# Altium project Charger Board.PrjPcb (part 3 of 3)

## Sheet Interlock.SchDoc
size A3
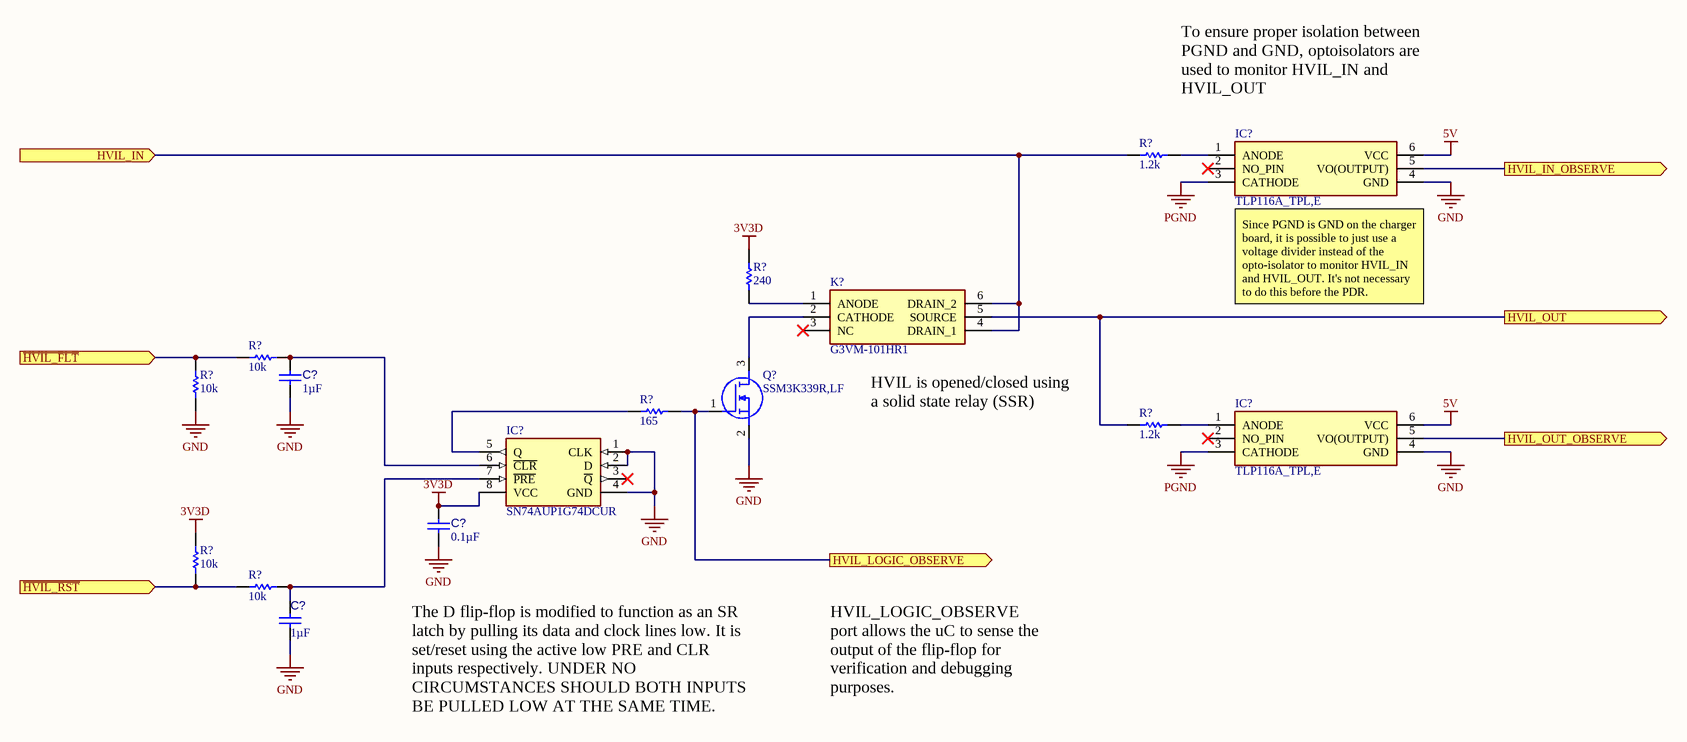
[diagram p4: Interlock.SchDoc]

### Parts
(Parts that share a designator on the sheet are numbered #1, #2 ... from top to bottom, then left to right.)
C?#25  1µF  [CAPC2013X145X50ML20T25]
C?#26  0.1µF  [CAPC2013X145X50ML20T25]
C?#27  1µF  [CAPC2013X145X50ML20T25]
IC?#3  TLP116A_TPL,E  [SOT127P700X230-6N]
IC?#4  TLP116A_TPL,E  [SOT127P700X230-6N]
IC?#5  SN74AUP1G74DCUR  [SOT50P310X90-8N]
K?  G3VM-101HR1  [G3VM101HR1]
Q?#4  SSM3K339R,LF  [SOTFL95P240X88-3N]
R?#30  1.2k  [RESC2013X50X35ML15T15]
R?#31  240  [RESC2013X50X35ML15T15]
R?#32  10k  [RESC2013X50X35ML15T15]
R?#33  10k  [RESC2013X50X35ML15T15]
R?#34  165  [RESC2013X50X35ML15T15]
R?#35  1.2k  [RESC2013X50X35ML15T15]
R?#36  10k  [RESC2013X50X35ML15T15]
R?#37  10k  [RESC2013X50X35ML15T15]

### Ports
HVIL_IN (in), HVIL_IN_OBSERVE (out), HVIL_LOGIC_OBSERVE (out), HVIL_OUT (out), HVIL_OUT_OBSERVE (out), ~{HVIL_FLT} (in), ~{HVIL_RST} (in)

### Nets
3V3D: C?#26.2 IC?#5.8(VCC) R?#31.1 R?#36.2
5V: IC?#3.6(VCC) IC?#4.6(VCC)
GND: C?#25.2 C?#26.1 C?#27.1 IC?#3.4(GND) IC?#4.4(GND) IC?#5.1(CLK) IC?#5.2(D) IC?#5.4(GND) Q?#4.2(S) R?#33.1
PGND: IC?#3.3(CATHODE) IC?#4.3(CATHODE)
NetC?#25_1: C?#25.1 IC?#5.6(~{CLR}) R?#32.1
NetC?#27_2: C?#27.2 IC?#5.7(~{PRE}) R?#37.1
NetIC?#2_92: Q?#4.1(G) R?#34.2 ; port HVIL_LOGIC_OBSERVE
NetIC?#2_93: IC?#3.5(VO(OUTPUT)) ; port HVIL_IN_OBSERVE
NetIC?#2_94: IC?#4.5(VO(OUTPUT)) ; port HVIL_OUT_OBSERVE
NetIC?#2_95: R?#32.2 R?#33.2 ; port ~{HVIL_FLT}
NetIC?#2_96: R?#36.1 R?#37.2 ; port ~{HVIL_RST}
NetIC?#3_1: IC?#3.1(ANODE) R?#30.2
NetIC?#4_1: IC?#4.1(ANODE) R?#35.2
NetIC?#5_5: IC?#5.5(Q) R?#34.1
NetJ?#8_1: K?.5(SOURCE) R?#35.1 ; port HVIL_OUT
NetJ?#8_2: K?.4(DRAIN_1) K?.6(DRAIN_2) R?#30.1 ; port HVIL_IN
NetK?_1: K?.1(ANODE) R?#31.2
NetK?_2: K?.2(CATHODE) Q?#4.3(D)

Not connected (* = marked no-connect by the designer): IC?#3 2(NO_PIN)*; IC?#4 2(NO_PIN)*; IC?#5 3(~{Q})*; K? 3(NC)*

### Notes on the sheet
- To ensure proper isolation between PGND and GND, optoisolators are used to monitor HVIL_IN and HVIL_OUT
- (near IC?#3) Since PGND is GND on the charger board, it is possible to just use a voltage divider instead of the opto-isolator to monitor HVIL_IN and HVIL_OUT. It's not necessary to do this before the PDR.
- (near K?) HVIL is opened/closed using a solid state relay (SSR)
- The D flip-flop is modified to function as an SR latch by pulling its data and clock lines low. It is set/reset using the active low PRE and CLR inputs respectively. UNDER NO CIRCUMSTANCES SHOULD BOTH INPUTS BE PULLED LOW AT THE SAME TIME.
- HVIL_LOGIC_OBSERVE port allows the uC to sense the output of the flip-flop for verification and debugging purposes.

### Library data of the parts
C?#25 C?#27 = CMP-001-00010-4: Chip Capacitor, 1 uF, +/-10%, 25 V, 0805 (2012 Metric); Manufacturer: KEMET; Manufacturer Part Number: C0805C105K3RACTU; Dielectric Material: Ceramic; Capacitance: 1uF; Tolerance: 10%; Dielectric: X7R; Voltage: 25V; Value: 1µF; Supplier 1: Digi-Key; Supplier Part Number 1: 399-8004-1-ND; RoHS: Yes; Category: Ceramic Capacitors; Stock 1: 360844; Pricing 1: 1=0.14000, 10=0.10100, 50=0.05720, 100=0.04740, 500=0.03322, 1000=0.02750 (USD); Mount: Surface Mount; Case/Package: 0805; Number of Pins: 2; Contact Plating: Tin,Matte; Case Code (Imperial): 0805; Case Code (Metric): 2012; Min Operating Temperature: -55°C; Max Operating Temperature: 125°C; Packaging: Tape and Reel; Termination: SMD/SMT; Package Quantity: 1; Voltage Rating: 25V; Voltage Rating (DC): 25V; Length: 2mm; Height: 1.25mm; Depth: 1.25mm; Width: 0.049inch; Thickness: 0.055inch; Radiation Hardening: No; REACH SVHC: No SVHC; ComponentLink1URL: https://datasheet.ciiva.com/6074/kem-c1002-x7r-smd-6074661.pdf?src-supplier=Farnell; ComponentLink1Description: https://datasheet.ciiva.com/6074/kem-c1002-x7r-smd-6074661.pdf?src-supplier=Farnell; ComponentLink2URL: https://datasheet.ciiva.com/28610/1918693-28610874.pdf?src-supplier=Element14; ComponentLink2Description: https://datasheet.ciiva.com/28610/1918693-28610874.pdf?src-supplier=Element14; ComponentLink3URL: https://datasheet.ciiva.com/46443/1851736-46443533.pdf?src-supplier=Element14; ComponentLink3Description: https://datasheet.ciiva.com/46443/1851736-46443533.pdf?src-supplier=Element14
C?#26 = CMP-001-00010-4: Chip Capacitor, 0.1 uF, +/-10%, 25 V, 0805 (2012 Metric); Manufacturer: KEMET; Manufacturer Part Number: C0805C104K3RACTU; Dielectric Material: Ceramic; Tolerance: 10%; Capacitance: 100nF; Dielectric: X7R; Voltage: 25V; Value: 0.1µF; Supplier 1: Digi-Key; Supplier Part Number 1: 399-1168-1-ND; RoHS: Yes; Category: Ceramic Capacitors; Stock 1: 417116; Pricing 1: 1=0.14000, 10=0.10000, 50=0.05660, 100=0.04680, 500=0.03284, 1000=0.02719 (USD); Mount: Surface Mount; Case/Package: 0805; Min Operating Temperature: -55°C; Max Operating Temperature: 125°C; Packaging: Tape and Reel; Termination: SMD/SMT; Length: 2mm; Height: 0.9mm; Depth: 1.25mm; Radiation Hardening: No; ComponentLink1URL: https://datasheet.ciiva.com/18193/getdatasheetpartid-385649-18193413.pdf?src-supplier=Verical; ComponentLink1Description: https://datasheet.ciiva.com/18193/getdatasheetpartid-385649-18193413.pdf?src-supplier=Verical; ComponentLink2URL: https://datasheet.ciiva.com/7842/kem-c1002-x7r-smd-7842536.pdf?src-supplier=Element14; ComponentLink2Description: https://datasheet.ciiva.com/7842/kem-c1002-x7r-smd-7842536.pdf?src-supplier=Element14; ComponentLink3URL: https://datasheet.ciiva.com/7842/kem-c1002-x7r-smd-7842538.pdf?src-supplier=Element14; ComponentLink3Description: https://datasheet.ciiva.com/7842/kem-c1002-x7r-smd-7842538.pdf?src-supplier=Element14
IC?#3 IC?#4 = TLP116A_TPL,E: Integrated Circuit; Manufacturer_Name: Toshiba; Manufacturer_Part_Number: TLP116A(TPL,E; Datasheet Link: https://media.digikey.com/pdf/Data%20Sheets/Toshiba%20PDFs/TLP116A.pdf; Height: 2.3mm; Arrow Part Number: TLP116A(TPL,E; Arrow Price/Stock: https://www.arrow.com/en/products/tlp116a-tple/toshiba; Mouser Part Number: 757-TLP116A(TPLE; Mouser Price/Stock: https://www.mouser.co.uk/ProductDetail/Toshiba/TLP116ATPLE?qs=HVbQlW5zcXWPuFTVF%252BZ0qw%3D%3D
IC?#5 = SN74AUP1G74DCUR: Integrated Circuit; Manufacturer_Name: Texas Instruments; Datasheet Link: http://www.ti.com/lit/gpn/sn74aup1g74; Height: 0.9mm; Manufacturer_Part_Number: SN74AUP1G74DCUR; Arrow Part Number: SN74AUP1G74DCUR; Arrow Price/Stock: https://www.arrow.com/en/products/sn74aup1g74dcur/texas-instruments; Mouser Part Number: 595-SN74AUP1G74DCUR; Mouser Price/Stock: https://www.mouser.co.uk/ProductDetail/Texas-Instruments/SN74AUP1G74DCUR?qs=7kv20MEVUlht0wF4P3v%252Bhg%3D%3D
K? = G3VM-101HR1: Relay or Contactor; Manufacturer_Name: Omron Electronics; Datasheet Link: https://componentsearchengine.com/Datasheets/1/G3VM-101HR1.pdf; Height: 2.1mm; Manufacturer_Part_Number: G3VM-101HR1; Arrow Part Number: G3VM-101HR1; Arrow Price/Stock: https://www.arrow.com/en/products/g3vm-101hr1/omron; Mouser Part Number: 653-G3VM-101HR1; Mouser Price/Stock: https://www.mouser.com/Search/Refine.aspx?Keyword=653-G3VM-101HR1
Q?#4 = SSM3K339R,LF: MOSFET (N-Channel); Manufacturer_Name: Toshiba; Datasheet Link: https://www.arrow.com/en/products/ssm3k339rlf/toshiba; Height: 0.88mm; Manufacturer_Part_Number: SSM3K339R,LF; Arrow Part Number: SSM3K339R,LF; Arrow Price/Stock: https://www.arrow.com/en/products/ssm3k339rlf/toshiba; Mouser Part Number: 757-SSM3K339RLF; Mouser Price/Stock: https://www.mouser.co.uk/ProductDetail/Toshiba/SSM3K339RLF?qs=vPP9GyyTAo2h4IM%252B%252BLvR%252BA%3D%3D
R?#30 R?#35 = CMP-009-00001-4: Chip Resistor, 1.2k Ohm, +/- 1%, 125 mW, -55 to 155 degC, 0805 (2012 Metric); Manufacturer: TE Connectivity; Manufacturer Part Number: CRGCQ0805F1K2; Resistance: 1.2kR; Max Power Dissipation: 125mW; Temperature Coefficient: 100ppm/°C; Value: 1.2k; Supplier 1: Digi-Key; Supplier Part Number 1: A129750CT-ND; RoHS: No; Category: Chip SMD Resistors; Stock 1: 34317; Pricing 1: 1=0.10000, 10=0.04700, 100=0.01890, 1000=0.00851, 2500=0.00738 (USD); Case/Package: 0805; Min Operating Temperature: -55°C; Max Operating Temperature: 155°C; Composition: Thick Film; Features: Moisture Resistant,Automotive AEC-Q200; Packaging: Cut Tape; Tolerance: 1%; Number of Terminations: 2; ComponentLink1URL: https://4donline.ihs.com/images/VipMasterIC/IC/TYEL/TYEL-S-A0004929575/TYEL-S-A0004929575-1.pdf?hkey=52A5661711E402568146F3353EA87419&src-supplier=Newark; ComponentLink1Description: https://4donline.ihs.com/images/VipMasterIC/IC/TYEL/TYEL-S-A0004929575/TYEL-S-A0004929575-1.pdf?hkey=52A5661711E402568146F3353EA87419&src-supplier=Newark; ComponentLink2URL: https://4donline.ihs.com/images/VipMasterIC/IC/TYEL/TYEL-S-A0004929575/TYEL-S-A0004929575-1.pdf?hkey=52A5661711E402568146F3353EA87419&src-supplier=Farnell; ComponentLink2Description: https://4donline.ihs.com/images/VipMasterIC/IC/TYEL/TYEL-S-A0004929575/TYEL-S-A0004929575-1.pdf?hkey=52A5661711E402568146F3353EA87419&src-supplier=Farnell; ComponentLink3URL: https://www.te.com/commerce/DocumentDelivery/DDEController?Action=srchrtrv&DocNm=1773204-3&DocType=DS&DocLang=English&src-supplier=Digi-Key; ComponentLink3Description: https://www.te.com/commerce/DocumentDelivery/DDEController?Action=srchrtrv&DocNm=1773204-3&DocType=DS&DocLang=English&src-supplier=Digi-Key
R?#31 = CMP-009-00001-4: Chip Resistor, 240 Ohm, +/- 1%, 125 mW, -55 to 155 degC, 0805 (2012 Metric); Manufacturer: Panasonic; Manufacturer Part Number: ERA-6AEB241V; Resistance: 240R; Power Rating: 125mW; Tolerance: 0.1%; Voltage Rating: 100V; Temperature Coefficient: 25ppm/°C; Value: 240; Supplier 1: Digi-Key; Supplier Part Number 1: P240DACT-ND; RoHS: Yes; Category: Chip SMD Resistors; Stock 1: 12724; Pricing 1: 1=0.33000, 10=0.27800, 100=0.10850, 1000=0.04541, 2500=0.04163 (USD); Mount: Surface Mount; Case/Package: 0805; Number of Pins: 2; Case Code (Metric): 2012; Case Code (Imperial): 0805; Contact Plating: Tin; Min Operating Temperature: -55°C; Max Operating Temperature: 155°C; Packaging: Tape and Reel; Package Quantity: 1; Composition: Thin Film; Number of Terminations: 2; Military Standard: Not; Termination: Solder; Max Power Dissipation: 125mW; Voltage Rating (DC): 100V; Features: Automotive AEC-Q200; Length: 2mm; Height: 0.5mm; Width: 1.25mm; Depth: 1.25mm; Radiation Hardening: No; REACH SVHC: No SVHC; Lead Free: Lead Free; ComponentLink1URL: https://datasheet.ciiva.com/29184/452815-da-01-en-widerstand-0805-era-29184072.pdf?src-supplier=Conrad; ComponentLink1Description: https://datasheet.ciiva.com/29184/452815-da-01-en-widerstand-0805-era-29184072.pdf?src-supplier=Conrad; ComponentLink2URL: https://datasheet.ciiva.com/5915/485442-5915205.pdf?src-supplier=Farnell; ComponentLink2Description: https://datasheet.ciiva.com/5915/485442-5915205.pdf?src-supplier=Farnell; ComponentLink3URL: https://datasheet.ciiva.com/43455/485442-43455397.pdf?src-supplier=Farnell; ComponentLink3Description: https://datasheet.ciiva.com/43455/485442-43455397.pdf?src-supplier=Farnell; ComponentLink4URL: https://datasheet.ciiva.com/30154/54aoa0000ce26-30154486.pdf?src-supplier=Onlinecomponents.com; ComponentLink4Description: https://datasheet.ciiva.com/30154/54aoa0000ce26-30154486.pdf?src-supplier=Onlinecomponents.com; ComponentLink5URL: https://datasheet.ciiva.com/48425/era-eng-tds-48425782.pdf?src-supplier=Distrelec; ComponentLink5Description: https://datasheet.ciiva.com/48425/era-eng-tds-48425782.pdf?src-supplier=Distrelec; ComponentLink6URL: https://datasheet.ciiva.com/5915/485442-5915208.pdf?src-supplier=Farnell; ComponentLink6Description: https://datasheet.ciiva.com/5915/485442-5915208.pdf?src-supplier=Farnell; ComponentLink7URL: https://datasheet.ciiva.com/46389/485442-46389960.pdf?src-supplier=Element14; ComponentLink7Description: https://datasheet.ciiva.com/46389/485442-46389960.pdf?src-supplier=Element14; ComponentLink8URL: https://datasheet.ciiva.com/46389/485442-46389961.pdf?src-supplier=Element14; ComponentLink8Description: https://datasheet.ciiva.com/46389/485442-46389961.pdf?src-supplier=Element14; ComponentLink9URL: https://datasheet.ciiva.com/48536/era-eng-tds-48536634.pdf?src-supplier=Distrelec; ComponentLink9Description: https://datasheet.ciiva.com/48536/era-eng-tds-48536634.pdf?src-supplier=Distrelec; ComponentLink10URL: https://datasheet.ciiva.com/22739/485442-22739483.pdf?src-supplier=Element14; ComponentLink10Description: https://datasheet.ciiva.com/22739/485442-22739483.pdf?src-supplier=Element14; ComponentLink11URL: https://datasheet.ciiva.com/17206/aoa0000ce26-17206700.pdf?src-supplier=Avnet+Europe; ComponentLink11Description: https://datasheet.ciiva.com/17206/aoa0000ce26-17206700.pdf?src-supplier=Avnet+Europe; ComponentLink12URL: https://datasheet.ciiva.com/43457/485442-43457869.pdf?src-supplier=Farnell; ComponentLink12Description: https://datasheet.ciiva.com/43457/485442-43457869.pdf?src-supplier=Farnell
R?#32 R?#36 R?#37 = CMP-009-00001-4: Chip Resistor, 10k Ohm, +/- 1%, 125 mW, -55 to 155 degC, 0805 (2012 Metric); Manufacturer: Yageo; Manufacturer Part Number: RC0805FR-0710KL; Resistance: 10kR; Temperature Coefficient: 100ppm/°C; Power Rating: 125mW; Voltage Rating: 150V; Value: 10k; Supplier 1: Digi-Key; Supplier Part Number 1: 311-10.0KCRCT-ND; RoHS: Yes; Category: Chip SMD Resistors; Stock 1: 19063106; Pricing 1: 1=0.10000, 10=0.03900, 100=0.01570, 1000=0.00705, 2500=0.00612 (USD); Case/Package: 0805; Case Code (Imperial): 0805; Case Code (Metric): 2012; Min Operating Temperature: -55°C; Max Operating Temperature: 155°C; Packaging: Tape and Reel; Tolerance: 1%; Composition: Thick Film; Package Quantity: 1; Termination: SMD/SMT; Number of Terminations: 2; Military Standard: Not; Max Power Dissipation: 125mW; Features: Moisture Resistant; Length: 2mm; Height: 0.024inch; Width: 0.049inch; Depth: 1.25mm; REACH SVHC: Unknown; Lead Free: Lead Free; ComponentLink1URL: https://datasheet.ciiva.com/11808/0900766b8106beab-11808151.pdf?src-supplier=RSComponents; ComponentLink1Description: https://datasheet.ciiva.com/11808/0900766b8106beab-11808151.pdf?src-supplier=RSComponents; ComponentLink2URL: https://datasheet.ciiva.com/12669/rc0805-12669688.pdf?src-supplier=Mouser; ComponentLink2Description: https://datasheet.ciiva.com/12669/rc0805-12669688.pdf?src-supplier=Mouser; ComponentLink3URL: https://datasheet.ciiva.com/46447/444164-46447563.pdf?src-supplier=Element14; ComponentLink3Description: https://datasheet.ciiva.com/46447/444164-46447563.pdf?src-supplier=Element14; ComponentLink4URL: https://datasheet.ciiva.com/2456/pyu-r-int-thick-7-2456972.pdf?src-supplier=Digi-Key; ComponentLink4Description: https://datasheet.ciiva.com/2456/pyu-r-int-thick-7-2456972.pdf?src-supplier=Digi-Key; ComponentLink5URL: https://datasheet.ciiva.com/2456/pyu-r-int-thick-7-2456973.pdf?src-supplier=Digi-Key; ComponentLink5Description: https://datasheet.ciiva.com/2456/pyu-r-int-thick-7-2456973.pdf?src-supplier=Digi-Key; ComponentLink6URL: https://datasheet.ciiva.com/2456/pyu-r-int-thick-7-2456974.pdf?src-supplier=Digi-Key; ComponentLink6Description: https://datasheet.ciiva.com/2456/pyu-r-int-thick-7-2456974.pdf?src-supplier=Digi-Key; ComponentLink7URL: https://datasheet.ciiva.com/16747/rc0805-16747087.pdf?src-supplier=Future+Electronics; ComponentLink7Description: https://datasheet.ciiva.com/16747/rc0805-16747087.pdf?src-supplier=Future+Electronics
R?#33 = CMP-009-00001-4: Chip Resistor, 1.2k Ohm, +/- 1%, 125 mW, -55 to 155 degC, 0805 (2012 Metric); Manufacturer: Yageo; Manufacturer Part Number: RC0805FR-0710KL; Resistance: 10kR; Temperature Coefficient: 100ppm/°C; Power Rating: 125mW; Voltage Rating: 150V; Value: 10k; Supplier 1: Digi-Key; Supplier Part Number 1: 311-10.0KCRCT-ND; RoHS: Yes; Category: Chip SMD Resistors; Stock 1: 19063106; Pricing 1: 1=0.10000, 10=0.03900, 100=0.01570, 1000=0.00705, 2500=0.00612 (USD); Case/Package: 0805; Case Code (Imperial): 0805; Case Code (Metric): 2012; Min Operating Temperature: -55°C; Max Operating Temperature: 155°C; Packaging: Tape and Reel; Tolerance: 1%; Composition: Thick Film; Package Quantity: 1; Termination: SMD/SMT; Number of Terminations: 2; Military Standard: Not; Max Power Dissipation: 125mW; Features: Moisture Resistant; Length: 2mm; Height: 0.024inch; Width: 0.049inch; Depth: 1.25mm; REACH SVHC: Unknown; Lead Free: Lead Free; ComponentLink1URL: https://datasheet.ciiva.com/11808/0900766b8106beab-11808151.pdf?src-supplier=RSComponents; ComponentLink1Description: https://datasheet.ciiva.com/11808/0900766b8106beab-11808151.pdf?src-supplier=RSComponents; ComponentLink2URL: https://datasheet.ciiva.com/12669/rc0805-12669688.pdf?src-supplier=Mouser; ComponentLink2Description: https://datasheet.ciiva.com/12669/rc0805-12669688.pdf?src-supplier=Mouser; ComponentLink3URL: https://datasheet.ciiva.com/46447/444164-46447563.pdf?src-supplier=Element14; ComponentLink3Description: https://datasheet.ciiva.com/46447/444164-46447563.pdf?src-supplier=Element14; ComponentLink4URL: https://datasheet.ciiva.com/2456/pyu-r-int-thick-7-2456972.pdf?src-supplier=Digi-Key; ComponentLink4Description: https://datasheet.ciiva.com/2456/pyu-r-int-thick-7-2456972.pdf?src-supplier=Digi-Key; ComponentLink5URL: https://datasheet.ciiva.com/2456/pyu-r-int-thick-7-2456973.pdf?src-supplier=Digi-Key; ComponentLink5Description: https://datasheet.ciiva.com/2456/pyu-r-int-thick-7-2456973.pdf?src-supplier=Digi-Key; ComponentLink6URL: https://datasheet.ciiva.com/2456/pyu-r-int-thick-7-2456974.pdf?src-supplier=Digi-Key; ComponentLink6Description: https://datasheet.ciiva.com/2456/pyu-r-int-thick-7-2456974.pdf?src-supplier=Digi-Key; ComponentLink7URL: https://datasheet.ciiva.com/16747/rc0805-16747087.pdf?src-supplier=Future+Electronics; ComponentLink7Description: https://datasheet.ciiva.com/16747/rc0805-16747087.pdf?src-supplier=Future+Electronics
R?#34 = CMP-009-00001-4: Chip Resistor, 165 Ohm, +/- 1%, 125 mW, -55 to 155 degC, 0805 (2012 Metric); Manufacturer: Panasonic; Manufacturer Part Number: ERA-6AEB1650V; Power Rating: 125mW; Tolerance: 0.1%; Voltage Rating: 100V; Resistance: 165R; Temperature Coefficient: 25ppm/°C; Value: 165; Supplier 1: Digi-Key; Supplier Part Number 1: P165DACT-ND; RoHS: Yes; Category: Chip SMD Resistors; Stock 1: 7632; Pricing 1: 1=0.33000, 10=0.27800, 100=0.10850, 1000=0.04541, 2500=0.04163 (USD); Mount: Surface Mount; Case/Package: 0805; Number of Pins: 2; Case Code (Imperial): 0805; Case Code (Metric): 2012; Contact Plating: Tin; Min Operating Temperature: -55°C; Max Operating Temperature: 155°C; Packaging: Tape and Reel; Composition: Metal Film,Thin Film; Features: Automotive AEC-Q200; Voltage Rating (DC): 100V; Number of Terminations: 2; Termination: Solder; Package Quantity: 1; Max Power Dissipation: 125mW; Length: 2mm; Height: 0.5mm; Width: 1.25mm; Depth: 1.25mm; Radiation Hardening: No; Lead Free: Lead Free; ComponentLink1URL: https://datasheet.ciiva.com/11815/0900766b80eb1d8c-11815736.pdf?src-supplier=RSComponents; ComponentLink1Description: https://datasheet.ciiva.com/11815/0900766b80eb1d8c-11815736.pdf?src-supplier=RSComponents; ComponentLink2URL: https://datasheet.ciiva.com/41450/001181180-da-01-en-widerstand-era-0805-165r-0-1-5000st-41450340.pdf?src-supplier=Conrad; ComponentLink2Description: https://datasheet.ciiva.com/41450/001181180-da-01-en-widerstand-era-0805-165r-0-1-5000st-41450340.pdf?src-supplier=Conrad; ComponentLink3URL: https://datasheet.ciiva.com/5950/485442-5950985.pdf?src-supplier=Farnell; ComponentLink3Description: https://datasheet.ciiva.com/5950/485442-5950985.pdf?src-supplier=Farnell; ComponentLink4URL: https://datasheet.ciiva.com/17207/aoa0000ce26-17207273.pdf?src-supplier=Avnet+Europe; ComponentLink4Description: https://datasheet.ciiva.com/17207/aoa0000ce26-17207273.pdf?src-supplier=Avnet+Europe; ComponentLink5URL: https://datasheet.ciiva.com/7942/485442-7942219.pdf?src-supplier=Element14; ComponentLink5Description: https://datasheet.ciiva.com/7942/485442-7942219.pdf?src-supplier=Element14; ComponentLink6URL: https://datasheet.ciiva.com/9185/aoa0000ce26-9185164.pdf?src-supplier=Avnet; ComponentLink6Description: https://datasheet.ciiva.com/9185/aoa0000ce26-9185164.pdf?src-supplier=Avnet; ComponentLink7URL: https://datasheet.ciiva.com/5950/485442-5950981.pdf?src-supplier=Farnell; ComponentLink7Description: https://datasheet.ciiva.com/5950/485442-5950981.pdf?src-supplier=Farnell; ComponentLink8URL: https://datasheet.ciiva.com/7942/485442-7942220.pdf?src-supplier=Element14; ComponentLink8Description: https://datasheet.ciiva.com/7942/485442-7942220.pdf?src-supplier=Element14

## Sheet Charger.SchDoc
size A
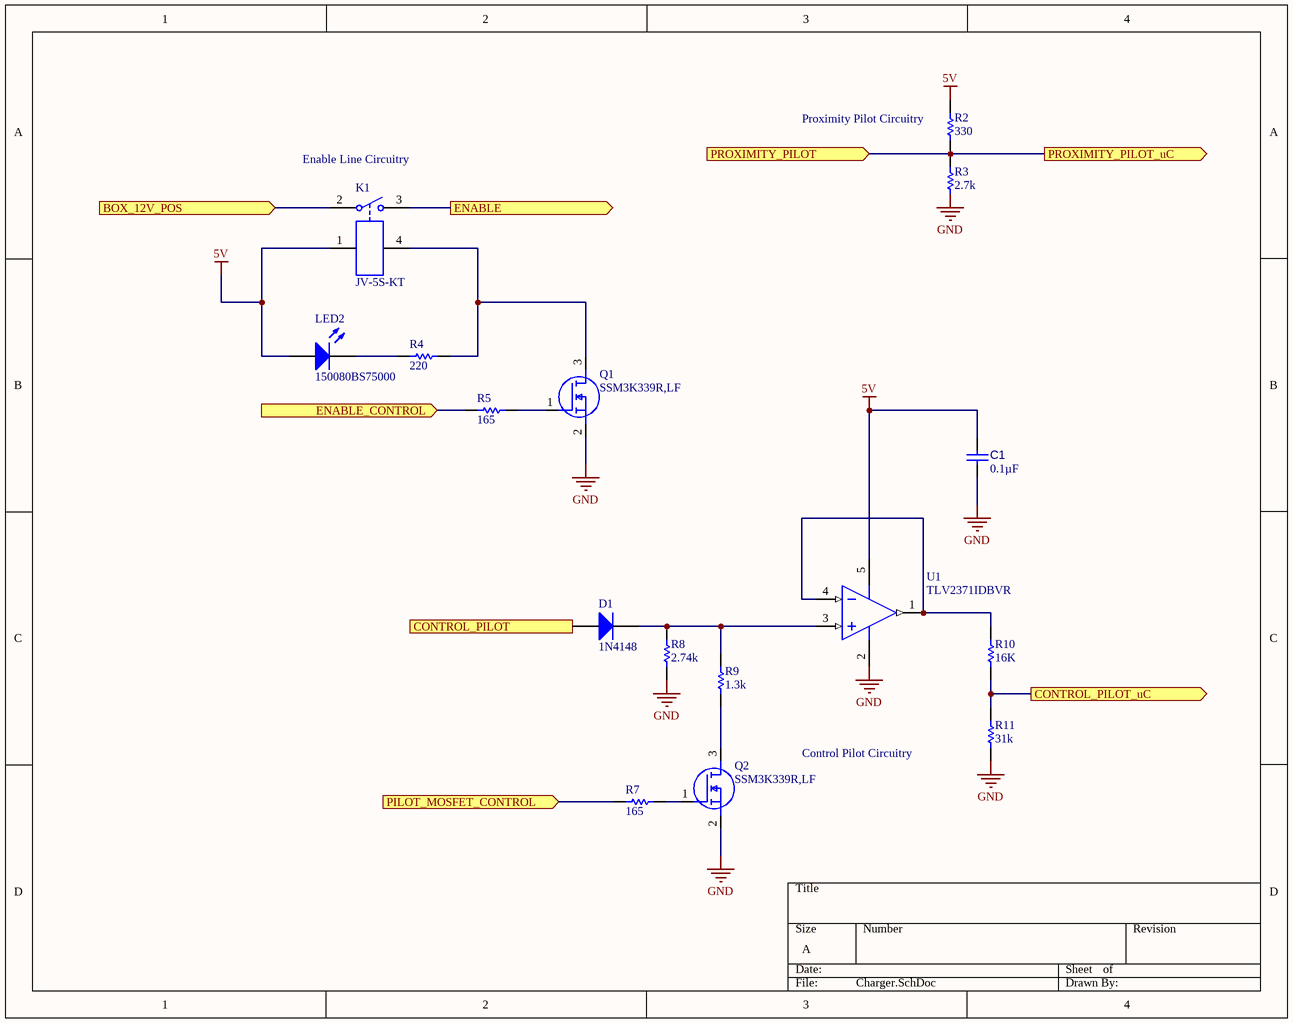
[diagram p5: Charger.SchDoc]

### Parts
C1  0.1µF  [CAPC2013X145X50ML20T25]
D1  1N4148  [NXP-SOD27-2_V]
K1  JV-5S-KT  [FJSU-JV-5S-KT_V]
LED2  150080BS75000  [0805_A]
Q1  SSM3K339R,LF  [SOTFL95P240X88-3N]
Q2  SSM3K339R,LF  [SOTFL95P240X88-3N]
R2  330  [RESC2013X50X35ML15T15]
R3  2.7k  [RESC2013X50X35ML15T15]
R4  220  [RESC2013X50X35ML15T15]
R5  165  [RESC2013X50X35ML15T15]
R7  165  [RESC2013X50X35ML15T15]
R8  2.74k  [RESC2013X50X35ML15T15]
R9  1.3k  [RESC2013X50X35ML15T15]
R10  16K  [RESC2013X50X35ML15T15]
R11  31k  [RESC2013X50X35ML15T15]
U1  TLV2371IDBVR  [DBV0005A_N]

### Ports
BOX_12V_POS (in), CONTROL_PILOT (in), CONTROL_PILOT_uC (out), ENABLE (out), ENABLE_CONTROL (in), PILOT_MOSFET_CONTROL (in), PROXIMITY_PILOT (in), PROXIMITY_PILOT_uC (out)

### Nets
5V: C1.2 K1.1 LED2.2(A) R2.2 U1.5(VDD)
GND: C1.1 Q1.2(S) Q2.2(S) R8.2 R11.2 U1.2(GND)
NetD1_1: D1.1(A) ; port CONTROL_PILOT
NetD1_2: D1.2(K) R8.1 R9.1 U1.3(IN+)
NetIC?#2_1: R10.2 R11.1 ; port CONTROL_PILOT_uC
NetIC?#2_12: R2.1 R3.2 ; port PROXIMITY_PILOT, port PROXIMITY_PILOT_uC
NetIC?#2_13: K1.3 ; port ENABLE
NetIC?#2_15: R7.1 ; port PILOT_MOSFET_CONTROL
NetJ?#12_2: K1.2 ; port BOX_12V_POS
NetK1_4: K1.4 Q1.3(D) R4.2
NetLED2_1: LED2.1(K) R4.1
NetQ1_1: Q1.1(G) R5.2
NetQ2_1: Q2.1(G) R7.2
NetQ2_3: Q2.3(D) R9.2
NetR5_1: R5.1 ; port ENABLE_CONTROL
NetR10_1: R10.1 U1.1(OUT) U1.4(IN-)

Not connected (* = marked no-connect by the designer): R3 1

### Notes on the sheet
- (near K1) Enable Line Circuitry
- (near R2) Proximity Pilot Circuitry
- (near R11) Control Pilot Circuitry
- Labels drawn without touching a wire or pin: GND

### Library data of the parts
C1 = CMP-001-00010-4: as C?#26 on sheet Interlock; Value: 0.1µF; Supplier 1: Digi-Key; Supplier Part Number 1: 399-1168-1-ND; RoHS: Yes; Category: Ceramic Capacitors; Stock 1: 417116; Pricing 1: 1=0.14000, 10=0.10000, 50=0.05660, 100=0.04680, 500=0.03284, 1000=0.02719 (USD); Mount: Surface Mount; Case/Package: 0805; Min Operating Temperature: -55°C; Max Operating Temperature: 125°C; Packaging: Tape and Reel; Termination: SMD/SMT; Length: 2mm; Height: 0.9mm; Depth: 1.25mm; Radiation Hardening: No; ComponentLink1URL: https://datasheet.ciiva.com/18193/getdatasheetpartid-385649-18193413.pdf?src-supplier=Verical; ComponentLink1Description: https://datasheet.ciiva.com/18193/getdatasheetpartid-385649-18193413.pdf?src-supplier=Verical; ComponentLink2URL: https://datasheet.ciiva.com/7842/kem-c1002-x7r-smd-7842536.pdf?src-supplier=Element14; ComponentLink2Description: https://datasheet.ciiva.com/7842/kem-c1002-x7r-smd-7842536.pdf?src-supplier=Element14; ComponentLink3URL: https://datasheet.ciiva.com/7842/kem-c1002-x7r-smd-7842538.pdf?src-supplier=Element14; ComponentLink3Description: https://datasheet.ciiva.com/7842/kem-c1002-x7r-smd-7842538.pdf?src-supplier=Element14
D1 = CMP-004-00000-1: High Speed Diode, 100 V, 0.45 A, -65 to 175 degC, 2-Pin SOD27, RoHS, Bulk; Manufacturer: Fairchild; Recovery Time: 4ns; Max Surge Current: 4A; Peak Reverse Current: 5uA; Elements: 1; Forward Current: 300mA; Power: 500mW; Forward Voltage: 1V; Package Reference: SOD27; Min Operating Temperature: -65°C; RoHS Compliant: True; Datasheet Version: Aug-04; Max Operating Temperature: 175°C; Pins: 2; Case/Package: DO; Packaging: Bulk; Package URL: http://www.nxp.com/documents/data_sheet/1N4148_1N4448.pdf; Package Quantity: 2000; Manufacturer URL: https://www.fairchildsemi.com/; Diameter: 1.91mm; Datasheet URL: http://www.nxp.com/documents/data_sheet/1N4148_1N4448.pdf
K1 = CMP-008-00001-2: Power Relay, 5 A, 125 Ohm, -40 to 70 degc, 4-Pin THD, RoHS; Manufacturer: Fujitsu; Contact Form: SPST; Operate Time: 8ms; ReleaseDateNum: 42843.325577338; Current Rating: 5A; Datasheet URL: http://www.fujitsu.com/downloads/MICRO/fcai/relays/jv.pdf; Package Reference: JV-5S-KT; Package Description: 4-Pin Through Hole Device, Body 17.5 x 10 mm, Picth 15.24 mm; Max Operating Temperature: 70°C; Min Operating Temperature: -40°C; Pins: 4; Mounting Technology: ThroughHole; RoHS Compliant: True; Datasheet Version: Apr-12
LED2 = CMP-1426-00008-1: SMD mono-color Chip LED, WL-SMCW, Blue; Manufacturer: Wuerth Elektronik; Color: Blue; ComponentLink2URL: http://katalog.we-online.com/led/datasheet/150080BS75000.pdf; ComponentLink1URL: http://www.we-online.com; ComponentLink2Description: Datasheet; PackageReference: 0805_A; ComponentLink1Description: Manufacturer URL; PartNumber: 150080BS75000
Q1 Q2 = SSM3K339R,LF: as Q?#4 on sheet Interlock; Datasheet Link: https://www.arrow.com/en/products/ssm3k339rlf/toshiba; Height: 0.88mm; Manufacturer_Part_Number: SSM3K339R,LF; Arrow Part Number: SSM3K339R,LF; Arrow Price/Stock: https://www.arrow.com/en/products/ssm3k339rlf/toshiba; Mouser Part Number: 757-SSM3K339RLF; Mouser Price/Stock: https://www.mouser.co.uk/ProductDetail/Toshiba/SSM3K339RLF?qs=vPP9GyyTAo2h4IM%252B%252BLvR%252BA%3D%3D
R2 R3 = CMP-009-00001-4: Chip Resistor, 1k Ohm, +/- 1%, 125 mW, -55 to 155 degC, 0805 (2012 Metric)
  R2: Value: 330
  R3: Value: 2.7k
R4 R10 R11 = CMP-009-00001-4: as R?#1 on sheet PartsTemplate
  R4: Value: 220
  R10: Value: 16K
  R11: Value: 31k
R5 R7 = CMP-009-00001-4: as R?#34 on sheet Interlock; Value: 165; Supplier 1: Digi-Key; Supplier Part Number 1: P165DACT-ND; RoHS: Yes; Category: Chip SMD Resistors; Stock 1: 7632; Pricing 1: 1=0.33000, 10=0.27800, 100=0.10850, 1000=0.04541, 2500=0.04163 (USD); Mount: Surface Mount; Case/Package: 0805; Number of Pins: 2; Case Code (Imperial): 0805; Case Code (Metric): 2012; Contact Plating: Tin; Min Operating Temperature: -55°C; Max Operating Temperature: 155°C; Packaging: Tape and Reel; Composition: Metal Film,Thin Film; Features: Automotive AEC-Q200; Voltage Rating (DC): 100V; Number of Terminations: 2; Termination: Solder; Package Quantity: 1; Max Power Dissipation: 125mW; Length: 2mm; Height: 0.5mm; Width: 1.25mm; Depth: 1.25mm; Radiation Hardening: No; Lead Free: Lead Free; ComponentLink1URL: https://datasheet.ciiva.com/11815/0900766b80eb1d8c-11815736.pdf?src-supplier=RSComponents; ComponentLink1Description: https://datasheet.ciiva.com/11815/0900766b80eb1d8c-11815736.pdf?src-supplier=RSComponents; ComponentLink2URL: https://datasheet.ciiva.com/41450/001181180-da-01-en-widerstand-era-0805-165r-0-1-5000st-41450340.pdf?src-supplier=Conrad; ComponentLink2Description: https://datasheet.ciiva.com/41450/001181180-da-01-en-widerstand-era-0805-165r-0-1-5000st-41450340.pdf?src-supplier=Conrad; ComponentLink3URL: https://datasheet.ciiva.com/5950/485442-5950985.pdf?src-supplier=Farnell; ComponentLink3Description: https://datasheet.ciiva.com/5950/485442-5950985.pdf?src-supplier=Farnell; ComponentLink4URL: https://datasheet.ciiva.com/17207/aoa0000ce26-17207273.pdf?src-supplier=Avnet+Europe; ComponentLink4Description: https://datasheet.ciiva.com/17207/aoa0000ce26-17207273.pdf?src-supplier=Avnet+Europe; ComponentLink5URL: https://datasheet.ciiva.com/7942/485442-7942219.pdf?src-supplier=Element14; ComponentLink5Description: https://datasheet.ciiva.com/7942/485442-7942219.pdf?src-supplier=Element14; ComponentLink6URL: https://datasheet.ciiva.com/9185/aoa0000ce26-9185164.pdf?src-supplier=Avnet; ComponentLink6Description: https://datasheet.ciiva.com/9185/aoa0000ce26-9185164.pdf?src-supplier=Avnet; ComponentLink7URL: https://datasheet.ciiva.com/5950/485442-5950981.pdf?src-supplier=Farnell; ComponentLink7Description: https://datasheet.ciiva.com/5950/485442-5950981.pdf?src-supplier=Farnell; ComponentLink8URL: https://datasheet.ciiva.com/7942/485442-7942220.pdf?src-supplier=Element14; ComponentLink8Description: https://datasheet.ciiva.com/7942/485442-7942220.pdf?src-supplier=Element14
R8 R9 = CMP-009-00001-4: Chip Resistor, 5.1k Ohm, +/- 1%, 125 mW, -55 to 155 degC, 0805 (2012 Metric)
  R8: Value: 2.74k
  R9: Value: 1.3k
U1 = CMP-0272-03303-3: 550 uA/Ch, 3 MHz, RRIO Operational Amplifier, 2.7 to 16 V, -40 to 125 degC, 5-pin SOT23 (DBV5), Green (RoHS & no Sb/Br); Manufacturer: Texas Instruments; Total Supply Voltage(Max)(+5V is 5, +/-5V is 10): 16; Sub Family: Low Supply Voltage Amplifier (<=2.7V), Precision Amplifier; CMRR(Min)(dB): 50; Slew Rate(Typ)(V/us): 2.4; Total Supply Voltage(Min)(+5V is 5, +/-5V is 10): 2.7; Packing: LARGE T&R; Vio (25C)(Max)(mV): 4.5; Iq per channel(Max)(mA): 0.9; Number of Channels: 1; Offset Drift(Typ)(uV/C): 2; Rating: Catalog; IIB(Max)(pA): 60; GBW(Typ)(MHz): 3; PackageVersion: 4073253-4/K, 03/2006; ComponentLink3URL: http://www.ti.com/litv/pdf/mpds018i; ComponentLink3Description: Package Specification; ComponentLink1URL: http://www.ti.com/; ComponentLink1Description: Manufacturer URL; PackageDescription: 5-Pin Plastic Small Outline, Body 1.6 x 2.9 mm, Pitch 0.95 mm; PartNumber: TLV2371IDBVR; Code_JEDEC: MO-178; PackageReference: DBV0005A; Eco-Plan: Green (RoHS & no Sb/Br); DatasheetVersion: SLOS270D; ComponentLink2URL: http://www.ti.com/lit/ds/symlink/tlv2371.pdf; ComponentLink2Description: Datasheet; Mounting Technology: Surface Mount

## Sheet Power.SchDoc
size A
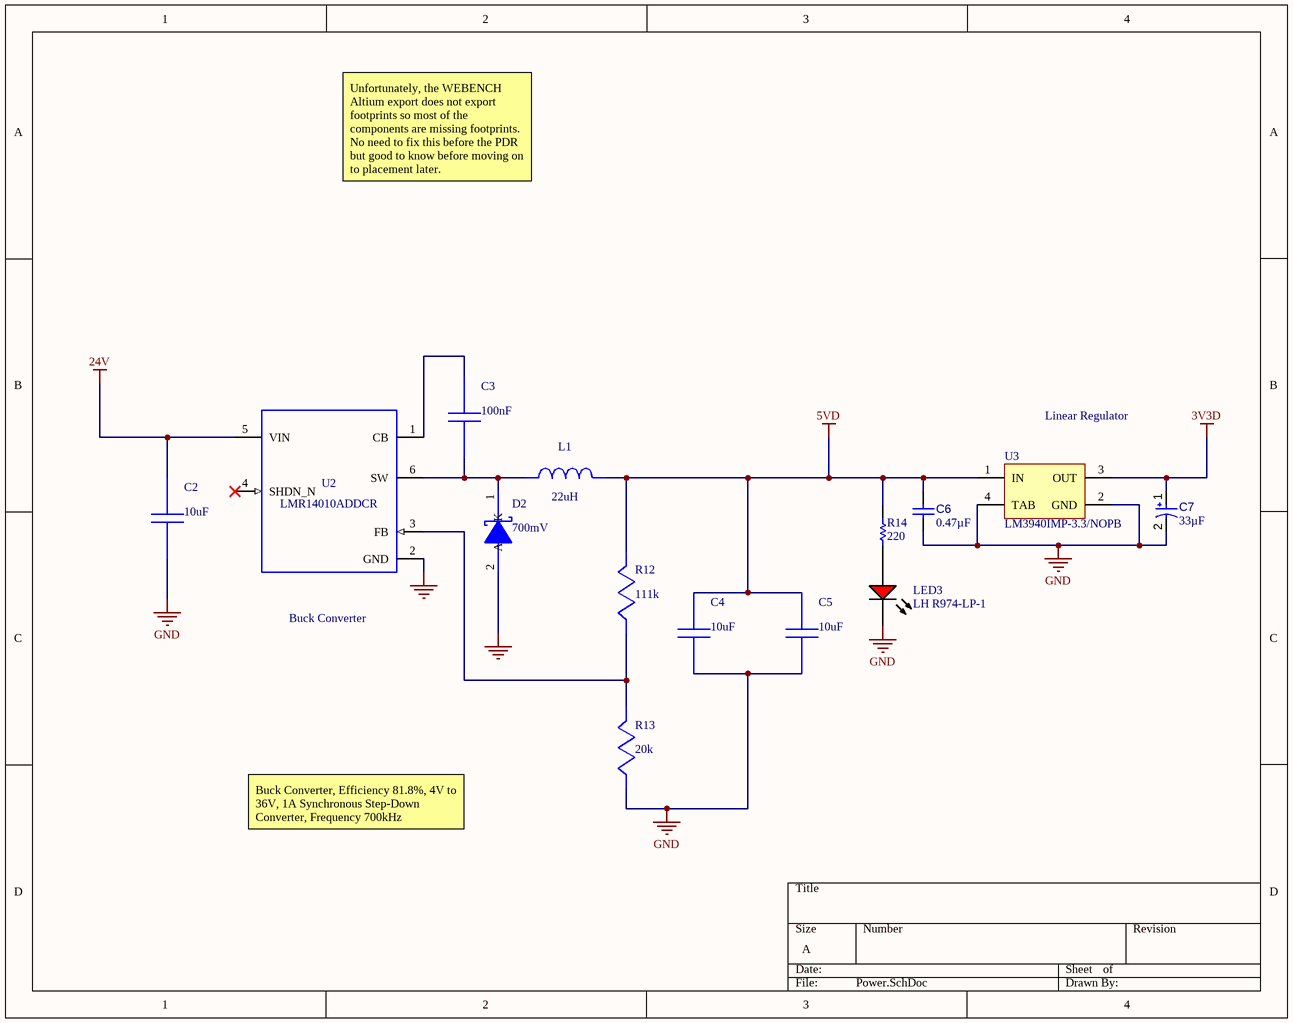
[diagram p6: Power.SchDoc]

### Parts
C2  value 10uF  (hidden comment: C3225X7R1H106M250AC)
C3  value 100nF  (hidden comment: C0805C104M5RACTU)
C4  value 10uF  (hidden comment: C3216X6S1V106K160AC)
C5  value 10uF  (hidden comment: C3216X6S1V106K160AC)
C6  0.47µF  [CAPC2013X145X50ML20T25]
C7  value 33µF  [KEMT-T491-D_M]  (hidden comment: T491D107K010AT)
D2  value 700mV  (hidden comment: SS26FL)
L1  value 22uH  (hidden comment: NPI105C220MTRF)
LED3  LH R974-LP-1  [0805_A]
R12  value 111k  (hidden comment: RT0805BRD07111KL)
R13  value 20k  (hidden comment: CRCW040220K0FKED)
R14  220  [RESC2013X50X35ML15T15]
U2  LMR14010ADDCR
U3  LM3940IMP-3.3/NOPB  [DCY0004A_M]

### Nets
0: D2.2(A) U2.2(GND)
3V3D: C7.1 U3.3(OUT)
5VD: C4.1 C5.1 C6.1 L1.2 R12.1 R14.1 U3.1(IN)
24V: C2.1 U2.5(VIN)
GND: C2.2 C4.2 C5.2 C6.2 C7.2 LED3.1(K) R13.2 U3.2(GND) U3.4(TAB)
NetC3_1: C3.1 U2.1(CB)
NetC3_2: C3.2 D2.1(K) L1.1 U2.6(SW)
NetLED3_2: LED3.2(A) R14.2
NetR12_2: R12.2 R13.1 U2.3(FB)

Not connected (* = marked no-connect by the designer): U2 4(SHDN_N)*

### Notes on the sheet
- Unfortunately, the WEBENCH Altium export does not export footprints so most of the components are missing footprints. No need to fix this before the PDR but good to know before moving on to placement later.
- Linear Regulator
- Buck Converter
- Buck Converter, Efficiency 81.8%, 4V to 36V, 1A Synchronous Step-Down Converter, Frequency 700kHz

### Library data of the parts
C2 = C3225X7R1H106M250AC: C3225X7R1H106M25; Manufacturer Name: TDK; PackageReference: C3225X7R1H106M250AC; Manufacturer Part Number: C3225X7R1H106M250AC
C3 = C0805C104M5RACTU: Manufacturer Name: Kemet; PackageReference: C0805C104M5RACTU; Manufacturer Part Number: C0805C104M5RACTU
C4 C5 = C3216X6S1V106K160AC: C3216X6S1V106K16; Manufacturer Name: TDK; PackageReference: C3216X6S1V106K160AC; Manufacturer Part Number: C3216X6S1V106K160AC
C6 = CMP-001-00010-4: Chip Capacitor, 1 uF, +/-10%, 25 V, 0805 (2012 Metric); Tolerance: 10%; Capacitor Type: Ceramic; Voltage Rating: 25V; Mounting Technology: SM; Case/Package: 0805; Max Operating Temperature: 125°C; RoHS Compliant: True; Value: 0.47µF; Min Operating Temperature: -55°C; Pins: 2
C7 = CMP-001-00037-5: Tantalum Surface Mount Capacitor-Standard Tantalum, 100 uF, +/- 10%, 10 V, -55 to 125 degC, 2917 (7343 Metric), RoHS, Tape and Reel; Manufacturer: Kemet; Ripple Current: 463mA; Voltage Rating: 10V; ESR: 700mohm; Manufacturer URL: http://www.kemet.com/; Case/Package: 2917; Tolerance: 10%; Datasheet URL: http://www.kemet.com/Lists/ProductCatalog/Attachments/254/KEM_T2005_T491.pdf; Packaging: TapeandReel; Pins: 2; Package Reference: T491-D; Package Description: 2-Pin Surface Mount Device, Body 7.3 x 4.3 mm; Min Operating Temperature: -55°C; Datasheet Version: Jun-16; Mounting Technology: SM; Package Quantity: 1; Capacitor Type: Tantalum; Max Operating Temperature: 125°C; RoHS Compliant: True
D2 = SS26FL: Manufacturer Name: Fairchild Semiconductor; PackageReference: SS26FL; Manufacturer Part Number: SS26FL
L1 = NPI105C220MTRF: Manufacturer Name: NIC Components; PackageReference: NPI105C220MTRF; Manufacturer Part Number: NPI105C220MTRF
LED3 = CMP-62016-000032-1: LED RED DIFFUSED 0805 SMD; Number of Elements: 1; Forward Voltage: 2.6V; Viewing Angle: 160°; Reverse Voltage: 5V; Test Current: 20mA; Dominant Wavelength: 645nm; Forward Current: 30mA; Luminous Intensity: 15mcd; Depth: 1.35mm; Min Operating Temperature: -30°C; Length: 2.1mm; Max Operating Temperature: 85°C; Radiation Hardening: No; Packaging: Tape and Reel; Number of Pins: 2; Mount: Surface Mount; Lens Style: Diffused
R12 = RT0805BRD07111KL: Manufacturer Name: Yageo; PackageReference: RT0805BRD07111KL; Manufacturer Part Number: RT0805BRD07111KL
R13 = CRCW040220K0FKED: Manufacturer Name: Vishay-Dale; PackageReference: CRCW040220K0FKED; Manufacturer Part Number: CRCW040220K0FKED
R14 = CMP-009-00001-4: as R?#1 on sheet PartsTemplate; Value: 220
U2 = LMR14010ADDCR: Manufacturer Name: Texas Instruments; PackageReference: LMR14010ADDCR; Manufacturer Part Number: LMR14010ADDCR; Value: N/A
U3 = CMP-0062-01788-3: 1A Low Dropout Regulator for 5V to 3.3V Conversion, 4-pin SOT-223, Pb-Free; Manufacturer: Texas Instruments; PowerWise: N; CompType: LDO IC; PackageTopMarking: XYTT*L52B; PackageDescription: Molded SOT-223, 6.50 x 3.56 x 1.6mm Body, 4 Lead, 2.3mm Pitch; ComponentLink1URL: http://www.ti.com/general/docs/lit/getliterature.tsp?genericPartNumber=LM3940&fileType=pdf; PackageReference: DCY0004A; RoHS: Y; ComponentLink1Description: Datasheet URL; PinCount: 4; Code_JEDEC: TO-261-AA; Code_IPC: SOT223-4

## Nets that join several sheets
3V3D: PartsTemplate (R?#2.2 R?#3.2), uController (38 pins), Connectors (F?#2.1 F?#6.1 F?#7.1 R?#27.1), Interlock (C?#26.2 IC?#5.8 R?#31.1 R?#36.2), Power (C7.1 U3.3)
5V: uController (C?#12.1 U?#1.3), Connectors (F?#4.1 F?#5.1), Interlock (IC?#3.6 IC?#4.6), Charger (5 pins)
GND: PartsTemplate (C?#2.1 Q?#3.2 SW?#2.1 SW?#2.2), TopLevel (MH?#1.1 MH?#2.1 MH?#3.1 MH?#4.1), uController (45 pins), Connectors (12 pins), Interlock (10 pins), Charger (6 pins), Power (9 pins)
CAN1_N: uController (R?#7.1 U?#1.6), Connectors (J?#6.2 J?#7.2)
CAN1_P: uController (R?#7.2 U?#1.7), Connectors (J?#6.1 J?#7.1)
NetD1_1: Connectors (J?#13.2), Charger (D1.1)
NetIC?#2_1: uController (IC?#2.1), Charger (R10.2 R11.1)
NetIC?#2_12: uController (IC?#2.12), Connectors (J?#13.1), Charger (R2.1 R3.2)
NetIC?#2_13: uController (IC?#2.13), Connectors (J?#12.1), Charger (K1.3)
NetIC?#2_15: uController (IC?#2.15), Charger (R7.1)
NetIC?#2_73: uController (IC?#2.73), Connectors (R?#29.1)
NetIC?#2_74: uController (IC?#2.74), Connectors (R?#28.1)
NetIC?#2_75: uController (IC?#2.75), Connectors (J?#5.3)
NetIC?#2_79: uController (IC?#2.79), Connectors (J?#5.4)
NetIC?#2_92: uController (IC?#2.92), Interlock (Q?#4.1 R?#34.2)
NetIC?#2_93: uController (IC?#2.93), Interlock (IC?#3.5)
NetIC?#2_94: uController (IC?#2.94), Interlock (IC?#4.5)
NetIC?#2_95: uController (IC?#2.95), Interlock (R?#32.2 R?#33.2)
NetIC?#2_96: uController (IC?#2.96), Interlock (R?#36.1 R?#37.2)
NetJ?#8_1: Connectors (J?#8.1), Interlock (K?.5 R?#35.1)
NetJ?#8_2: Connectors (J?#8.2), Interlock (K?.4 K?.6 R?#30.1)
NetJ?#12_2: Connectors (J?#12.2), Charger (K1.2)
NetR5_1: uController (R15.2), Charger (R5.1)